# EAGLE design main_v2 (EAGLE 7.5.0)
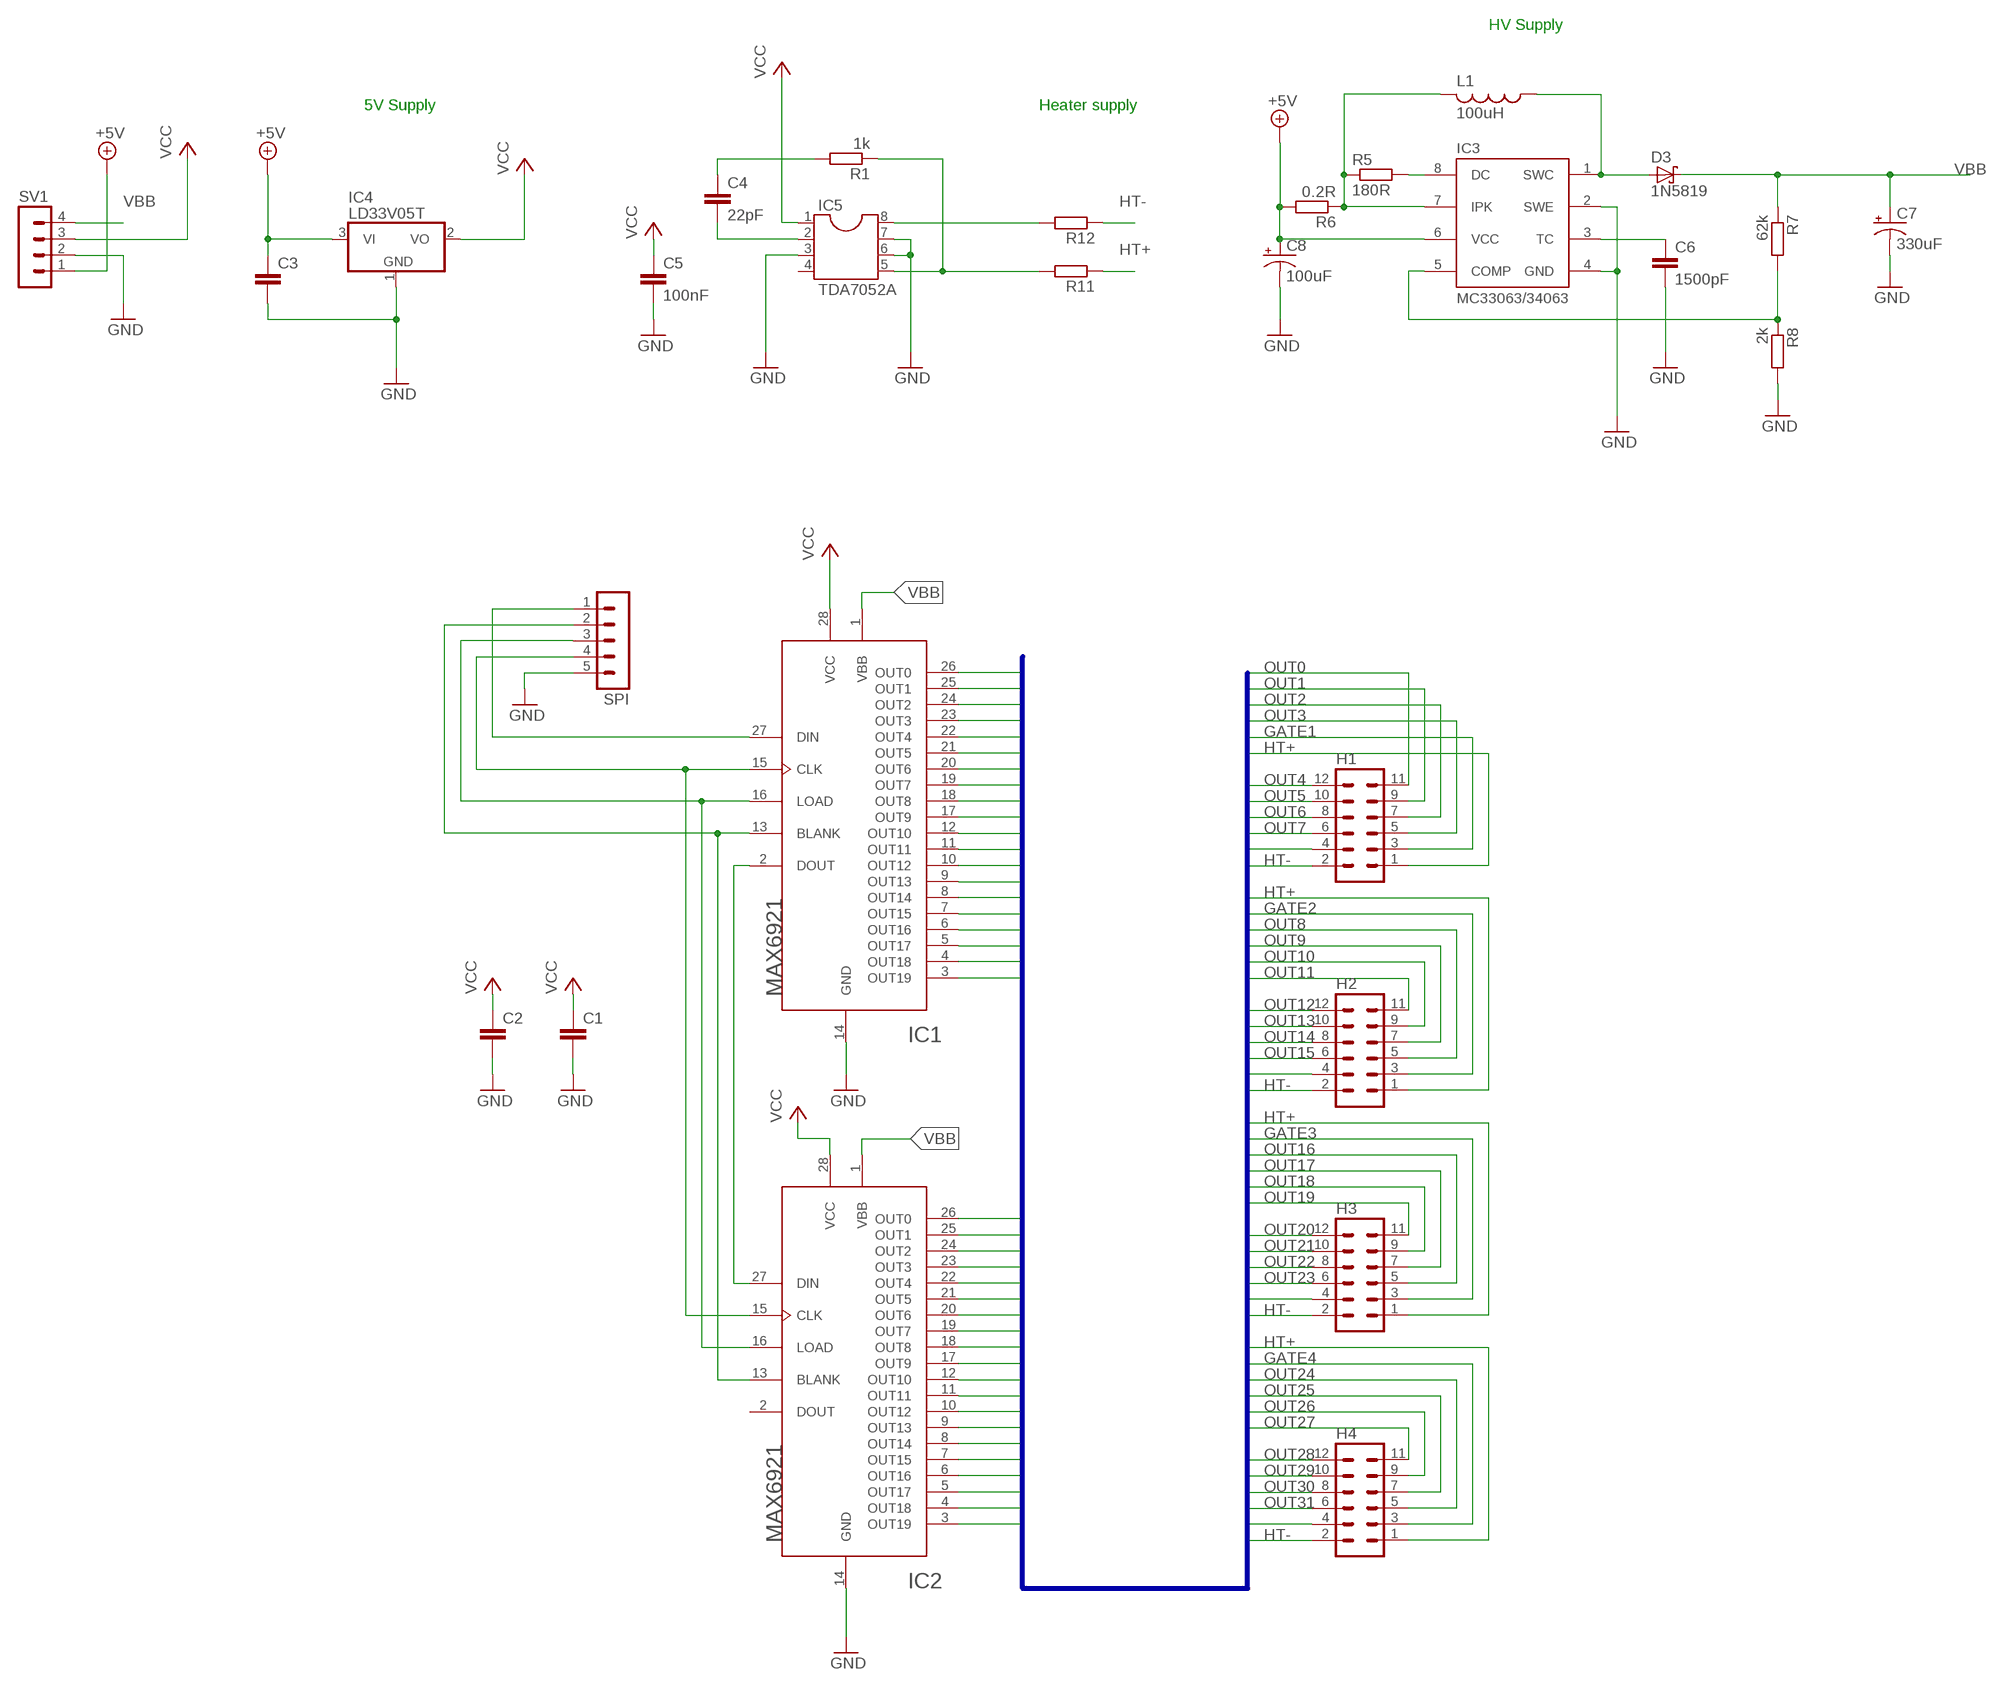
[diagram p0: schematic, sheet 1]

## Parts
C1  C-EU025-025X050  [C025-025X050]
C2  C-EU025-025X050  [C025-025X050]
C3  C-EU025-025X050  [C025-025X050]
C4  22pF  C-EU025-025X050  [C025-025X050]
C5  100nF  C-EU025-025X050  [C025-025X050]
C6  1500pF  C-EU025-025X050  [C025-025X050]
C7  330uF  CPOL-USE3.5-8  [E3,5-8]
C8  100uF  CPOL-USE2.5-5  [E2,5-5]
D3  1N5819  SCHOTTKY-DIODEDO35-7  [DO35-7]
H1  MA06-2  [MA06-2]
H2  MA06-2  [MA06-2]
H3  MA06-2  [MA06-2]
H4  MA06-2  [MA06-2]
IC1  MAX6921  [PLCC-S28]
IC2  MAX6921  [PLCC-S28]
IC3  MC33063  MC33063/MC34063P  [DIL08]
IC4  LD33V05T  [TO220H]
IC5  TDA7052A  DIL8  [DIL08]
L1  100uH  L-US6000-XXX-RC  [6000-XXXX-RC]
R1  1k  R-EU_0204/7  [0204/7]
R5  180R  R-EU_0204/7  [0204/7]
R6  0.2R  R-EU_0207/10  [0207/10]
R7  62k  R-EU_0204/7  [0204/7]
R8  2k  R-EU_0204/7  [0204/7]
R11  R-EU_0204/7  [0204/7]
R12  R-EU_0204/7  [0204/7]
SPI  MA05-1  [MA05-1]
SV1  MA04-1  [MA04-1]

## Nets
+5V: C3.1 C8.+ IC3.6(VCC) IC4.3(VI) R6.2 SV1.1
GATE1: H1.3 IC2.12(OUT10)
GATE2: H2.3 IC2.18(OUT8)
GATE3: H3.3 IC1.12(OUT10)
GATE4: H4.3 IC1.25(OUT1)
GND: C1.2 C2.2 C3.2 C5.2 C6.2 C7.- C8.- IC1.14(GND) IC2.14(GND) IC3.2(SWE) IC3.4(GND) IC4.1(GND) IC5.3 IC5.6 IC5.7 R8.2 SPI.5 SV1.2
HT+: H1.1 H2.1 H3.1 H4.1 R11.1
HT-: H1.2 H2.2 H3.2 H4.2 R12.1
MOSI: IC1.27(DIN) SPI.1
N$1: IC1.2(DOUT) IC2.27(DIN)
N$2: IC5.8 R12.2
N$3: IC1.13(BLANK) IC2.13(BLANK) SPI.2
N$4: IC1.16(LOAD) IC2.16(LOAD) SPI.3
N$5: C6.1 IC3.3(TC)
N$6: IC5.5 R1.1 R11.2
N$7: D3.A IC3.1(SWC) L1.1
N$8: IC3.7(IPK) L1.2 R5.1 R6.1
N$9: IC3.8(DC) R5.2
N$10: C4.2 IC5.2
N$11: IC3.5(COMP) R7.2 R8.1
N$12: C4.1 R1.2
OUT0: H1.11 IC2.10(OUT12)
OUT1: H1.9 IC2.7(OUT15)
OUT2: H1.7 IC2.5(OUT17)
OUT3: H1.5 IC2.11(OUT11)
OUT4: H1.12 IC2.9(OUT13)
OUT5: H1.10 IC2.8(OUT14)
OUT6: H1.8 IC2.6(OUT16)
OUT7: H1.6 IC2.3(OUT19)
OUT8: H2.5 IC2.21(OUT5)
OUT9: H2.7 IC2.23(OUT3)
OUT10: H2.9 IC2.25(OUT1)
OUT11: H2.11 IC2.19(OUT7)
OUT12: H2.12 IC2.20(OUT6)
OUT13: H2.10 IC2.26(OUT0)
OUT14: H2.8 IC2.24(OUT2)
OUT15: H2.6 IC2.22(OUT4)
OUT16: H3.5 IC1.11(OUT11)
OUT17: H3.7 IC1.8(OUT14)
OUT18: H3.9 IC1.9(OUT13)
OUT19: H3.11 IC1.10(OUT12)
OUT20: H3.12 IC1.7(OUT15)
OUT21: H3.10 IC1.6(OUT16)
OUT22: H3.8 IC1.5(OUT17)
OUT23: H3.6 IC1.3(OUT19)
OUT24: H4.5 IC1.23(OUT3)
OUT25: H4.7 IC1.21(OUT5)
OUT26: H4.9 IC1.22(OUT4)
OUT27: H4.11 IC1.19(OUT7)
OUT28: H4.12 IC1.20(OUT6)
OUT29: H4.10 IC1.18(OUT8)
OUT30: H4.8 IC1.17(OUT9)
OUT31: H4.6 IC1.24(OUT2)
SCK: IC1.15(CLK) IC2.15(CLK) SPI.4
SPARE1: H1.4 IC2.4(OUT18)
SPARE2: H2.4 IC2.17(OUT9)
SPARE3: H3.4 IC1.4(OUT18)
SPARE4: H4.4 IC1.26(OUT0)
VBB: C7.+ D3.C IC1.1(VBB) IC2.1(VBB) R7.1 SV1.4
VCC: C1.1 C2.1 C5.1 IC1.28(VCC) IC2.28(VCC) IC4.2(VO) IC5.1 SV1.3
Unconnected: IC2.2(DOUT) IC5.4

## Buses
OUT[0..32],HT+[1..4],HT-,HT+,GATE[1..4],SPARE[1..4]

## Notes on the sheet
- HV Supply
- 5V Supply | Heater supply

## Library data of the parts
C1-C6 = resistor:C-EU: CAPACITOR, European symbol
C7 C8 = adafruit:CPOL-US: POLARIZED CAPACITOR, American symbol
D3 = adafruit:SCHOTTKY-DIODE: Schottky Diode
H1-H4 = con-lstb:MA06-2: PIN HEADER; OC_FARNELL: unknown; OC_NEWARK: unknown
IC1 IC2 = adafruit:MAX6921: MAX6921 76V VFD driver in TSSOP and PLCC. Can be cascaded, talk to it via SPI
IC3 = adafruit:MC33063/MC34063: MC33063 and MC34063 Basic DC/DC converter with internal power-NPN transistor, 100KHz, 1.5A peak switch current. 3-40 input/output.
IC4 = ld33v:LD33V: Positive VOLTAGE REGULATOR Source: http://cache.national.com/ds/LM/LM78L05.pdf http://www.fairchildsemi.com/ds/LM/LM7805.pdf
IC5 = ic-package:DIL8: Dual In Line / Socket
L1 = rcl:L-US: INDUCTOR, American symbol
R1 R5-R8 R11 R12 = resistor:R-EU_: RESISTOR, European symbol
SPI = con-lstb:MA05-1: PIN HEADER; OC_FARNELL: unknown; OC_NEWARK: unknown
SV1 = con-lstb:MA04-1: PIN HEADER; OC_FARNELL: unknown; OC_NEWARK: unknown

## Board
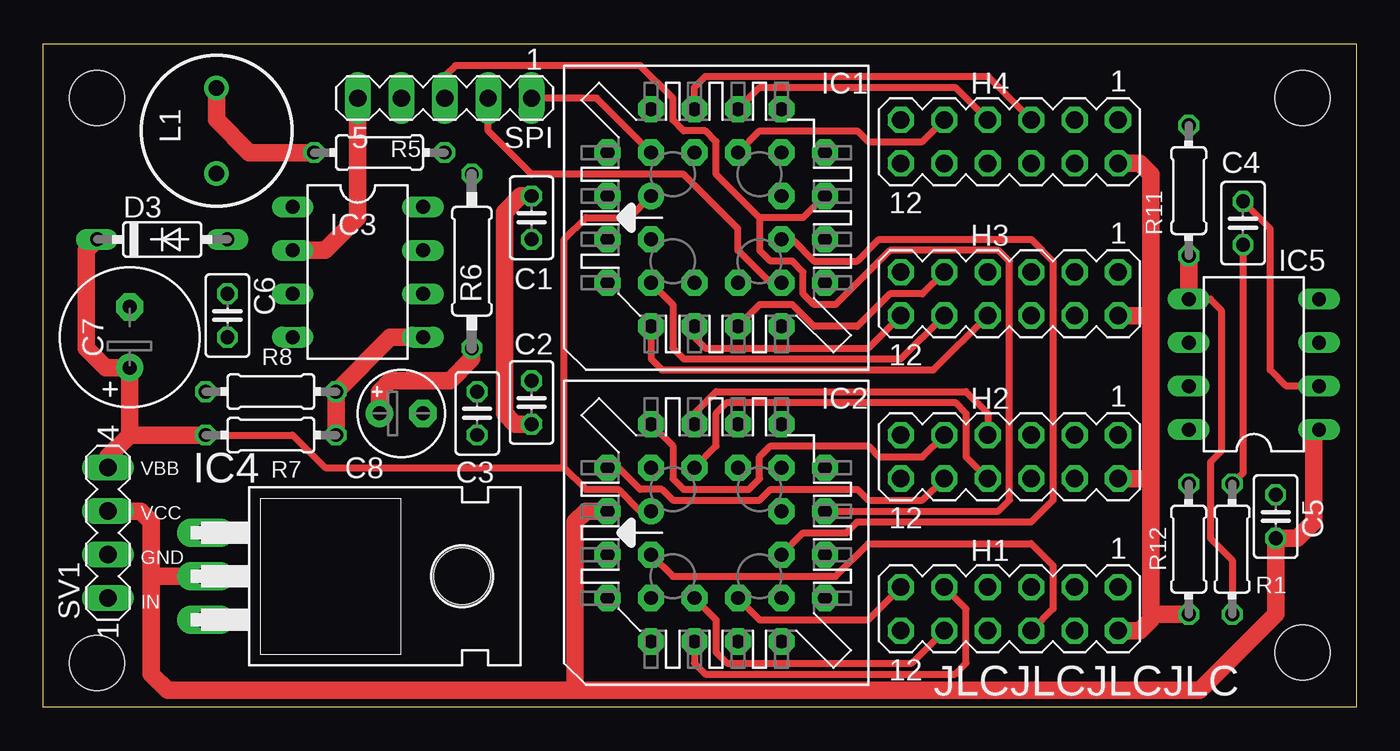
[diagram p1: board, top side]
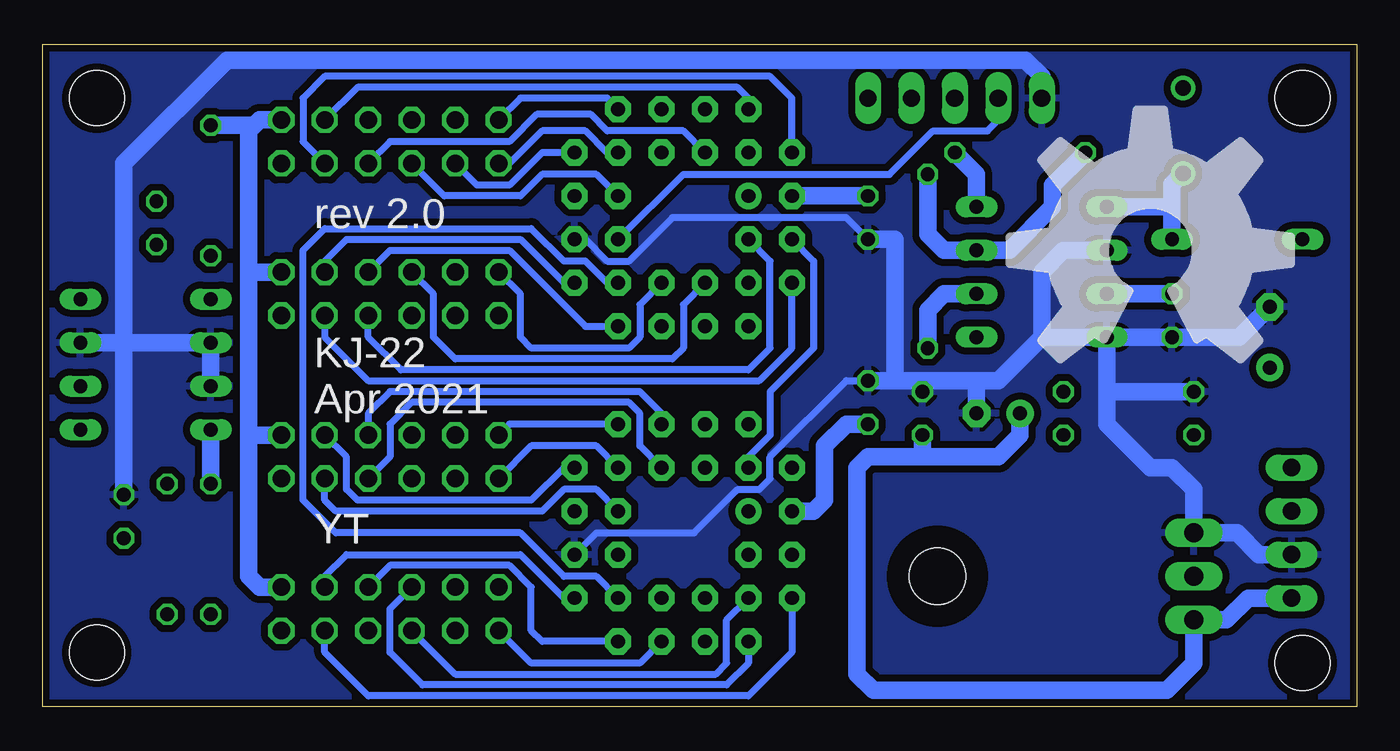
[diagram p2: board, bottom side, seen from below]

Size 76.81 x 38.72 mm. Coordinates in mm from the lower left corner, seen from the top.
Outline: 0,0 76.81,0 76.81,38.72 0,38.72 0,0
Copper layers (1*16): Top 0.035559375mm / dielectric 1.6mm / Bottom 0.035559375mm
Design rules "oshpark dru": minimum track width 6mil, minimum drill 10mil, track to track 6mil, track to pad 6mil, pad to pad 6mil, via to via 6mil, smd to smd 6mil, copper to edge 15mil, drill to drill 6mil, minimum pad ring 5mil, minimum via ring 5mil, stop-mask expansion 2.5mil, vias tented up to drill 0mil, thermal gap 10mil
Holes 3.2 mm at 3.17,2.54 3.17,35.56 73.66,3.17 73.66,35.56

### Footprints (pad centres in the part's own frame; a part is rotated, then mirrored left to right if it is on the bottom)
C025-025X050 = drill 0.813 octagon: 1 -1.27,0; 2 1.27,0
E3,5-8 = drill 0.813 pad 1.6: + -1.778,0 | drill 0.813 pad 1.6 octagon: - 1.778,0
E2,5-5 = drill 0.813 pad 1.6: + -1.27,0 | drill 0.813 pad 1.6 octagon: - 1.27,0
DO35-7 = drill 0.813 long: A 3.81,0; C -3.81,0
MA06-2 = drill 1.016 octagon: 1 -6.35,-1.27; 2 -6.35,1.27; 3 -3.81,-1.27; 4 -3.81,1.27; 5 -1.27,-1.27; 6 -1.27,1.27; 7 1.27,-1.27; 8 1.27,1.27; 9 3.81,-1.27; 10 3.81,1.27; 11 6.35,-1.27; 12 6.35,1.27
PLCC-S28 = drill 0.813 pad 1.524: 1 1.27,3.81 | drill 0.813 pad 1.524 octagon: 2 -1.27,6.35; 3 -1.27,3.81; 4 -3.81,6.35; 5 -6.35,3.81; 6 -3.81,3.81; 7 -6.35,1.27; 8 -3.81,1.27; 9 -6.35,-1.27; 10 -3.81,-1.27; 11 -6.35,-3.81; 12 -3.81,-6.35; 13 -3.81,-3.81; 14 -1.27,-6.35; 15 -1.27,-3.81; 16 1.27,-6.35; 17 1.27,-3.81; 18 3.81,-6.35; 19 6.35,-3.81; 20 3.81,-3.81; 21 6.35,-1.27; 22 3.81,-1.27; 23 6.35,1.27; 24 3.81,1.27; 25 6.35,3.81; 26 3.81,6.35; 27 3.81,3.81; 28 1.27,6.35
DIL08 = drill 0.813 long: 1 -3.81,-3.81; 2 -1.27,-3.81; 3 1.27,-3.81; 4 3.81,-3.81; 5 3.81,3.81; 6 1.27,3.81; 7 -1.27,3.81; 8 -3.81,3.81
TO220H = drill 1.118 long: 1 -2.54,-10.16; 2 0,-10.16; 3 2.54,-10.16 | hole 3.302: 0,4.826
6000-XXXX-RC = drill 0.9 pad 1.422: 1 -2.5,0; 2 2.5,0
0204/7 = drill 0.813 octagon: 1 -3.81,0; 2 3.81,0
0207/10 = drill 0.813 octagon: 1 -5.08,0; 2 5.08,0
MA05-1 = drill 1.016 long: 1 -5.08,0; 2 -2.54,0; 3 0,0; 4 2.54,0; 5 5.08,0
MA04-1 = drill 1.016 long: 1 -3.81,0; 2 -1.27,0; 3 1.27,0; 4 3.81,0

### Placement (x,y rotation side)
C1  28.57,17.78 90 top
C2  28.57,28.57 270 top
C3  25.4,17.14 90 top
C4  70.17,28.26 90 top
C5  72.07,11.11 90 top
C6  10.79,22.86 270 top
C7  5.08,21.59 90 top
C8  20.95,17.14 0 top
D3  6.99,27.3 0 top
H1  56.52,5.71 180 top
H2  56.52,14.61 180 top
H3  56.52,24.13 180 top
H4  56.52,33.02 180 top
IC1  39.37,28.57 90 top
IC2  39.37,10.16 90 top
IC3  18.41,25.4 270 top
IC4  19.68,7.62 270 top
IC5  70.8,20 90 top
L1  10.16,33.66 90 top
R1  69.53,9.21 90 top
R5  19.68,32.38 0 top
R6  25.08,26.04 270 top
R7  13.34,15.88 0 top
R8  13.34,18.41 180 top
R11  66.99,30.16 270 top
R12  66.99,9.21 90 top
SPI  23.5,35.56 180 top
SV1  3.81,10.16 90 top

### Tracks (layer width: path | path; a pad name or v marks a point on that pad's centre or on a via)
+5V
  Top 1.016: C8.+ 19.68,18.41 20.32,19.05 23.81,19.05 25.08,20.32 R6.2
  Bottom 1.016: IC3.6 24.13,24.13 25.08,23.18 R6.2 | SV1.1 6.35,6.35 7.62,5.08 IC4.3 9.53,2.54 11.11,0.95 28.26,0.95 29.21,1.91 29.21,13.97 28.57,14.61 25.4,14.61 | C8.+ 19.68,15.88 20.95,14.61 25.4,14.61 | C3.1 25.4,14.61
GATE1
  Bottom 0.406: H1.3 60.33,7.62 59.05,8.89 48.9,8.89 46.35,6.35 IC2.12
GATE2
  Bottom 0.406: IC2.18 46.35,13.97 48.26,12.06 58.42,12.06 59.05,12.7 59.05,14.61 H2.3
GATE3
  Bottom 0.406: H3.3 60.33,26.04 59.05,27.3 48.9,27.3 46.35,24.77 IC1.12
GATE4
  Bottom 0.406: IC1.25 35.56,35.56 36.2,36.2 58.42,36.2 H4.3
GND
  Top 1.016: SPI.5 18.41,28.57 16.51,26.67 IC3.2
  Bottom 0.406: IC2.14 44.45,10.16 38.73,10.16 36.2,12.7 34.92,12.7 34.29,13.34 34.29,14.61 29.84,19.05 C1.2 | C2.2 29.84,28.57 40.01,28.57 42.55,26.04 43.81,26.04 45.09,27.3 IC1.14
  Bottom 1.016: 18.41,21.59 18.41,25.4 17.14,26.67 IC3.2 | 18.41,21.59 IC3.4 | IC3.4 C6.2 6.86,21.59 C7.- | C8.- 22.23,19.05 | 18.41,21.59 20.95,19.05 22.23,19.05 | 14.61,18.41 14.61,16.51 12.06,13.97 10.79,13.97 9.53,12.7 IC4.1 6.99,10.16 5.71,8.89 SV1.2 | 14.61,18.41 IC3.4 | R8.2 14.61,18.41 | 72.07,21.27 IC5.6 IC5.7 | 72.07,21.27 IC5.3 | C2.2 26.99,27.3 26.99,19.37 26.67,19.05 | 22.23,19.05 25.4,19.05 | 25.4,19.05 26.67,19.05 | C3.2 25.4,19.05 | C1.2 26.67,19.05 | SPI.5 18.41,36.83 19.37,37.78 66.04,37.78 72.07,31.75 72.07,21.27 | C5.2 72.07,21.27
  pour Bottom (isolate 0.406): 0,0 76.83,0 76.83,38.73 0,38.73
HT+
  Bottom 1.016: H4.1 64.14,34.29 64.45,33.97 | 64.45,33.97 64.77,33.66 64.77,25.4 | 64.77,25.4 64.77,15.88 | 64.77,15.88 64.77,7.62 64.14,6.99 H1.1 | H3.1 64.77,25.4 | H2.1 64.77,15.88 | R11.1 64.45,33.97
HT-
  Top 1.016: H1.2 64.14,4.45 64.77,5.08 64.77,5.4 | 64.77,5.4 64.77,13.34 | H2.2 64.77,13.34 | 64.77,13.34 64.77,22.86 | 64.77,22.86 64.77,31.11 64.14,31.75 H4.2 | H3.2 64.77,22.86 | R12.1 64.77,5.4
MOSI
  Top 0.406: IC1.27 32.38,35.56 SPI.1
N$1
  Bottom 0.406: IC1.2 31.75,26.04 31.75,20.95 34.29,18.41 34.29,15.88 35.56,14.61 IC2.27
N$2
  Bottom 1.016: IC5.8 R12.2
N$3
  Top 0.406: IC1.13 42.55,24.77 40.64,26.67 40.64,27.94 37.47,31.11 28.57,31.11 26.04,33.66 SPI.2
  Bottom 0.406: IC2.13 44.45,7.62 46.35,7.62 48.9,10.16 59.69,10.16 61.59,12.06 61.59,26.67 60.33,27.94 48.26,27.94 46.35,26.04 45.09,26.04 43.81,24.77 IC1.13
N$4
  Top 0.406: IC2.16 55.88,11.43 56.52,12.06 56.52,26.04 55.88,26.67 49.53,26.67 46.35,23.5 45.09,23.5 44.45,24.13 44.45,25.4 43.81,26.04 42.55,26.04 41.91,26.67 41.91,28.57 | IC1.16 44.45,28.57 41.91,28.57 | 41.91,28.57 39.37,31.11 39.37,33.02 38.73,33.66 37.47,33.66 36.83,34.29 36.83,35.56 34.92,37.47 24.13,37.47 23.5,36.83 SPI.3
N$5
  Bottom 1.016: C6.1 IC3.3
N$6
  Top 0.406: IC5.5 68.26,23.81 68.9,23.18 68.9,14.92 68.26,14.29 68.26,9.84 69.53,8.57 R1.1
  Top 1.016: IC5.5 R11.2
N$7
  Bottom 1.016: 14.64,29.25 IC3.1 10.79,29.21 D3.A 10.79,30.52 L1.1
N$8
  Top 1.016: R5.1 12.06,32.38 10.16,34.29 L1.2
  Bottom 1.016: R6.1 25.08,27.62 24.13,26.67 IC3.7 20.32,26.67 17.78,29.21 17.78,30.48 R5.1
N$9
  Bottom 1.016: IC3.8 22.23,31.11 R5.2
N$10
  Top 0.406: IC5.2 72.71,18.73 71.75,19.68 71.75,27.94 C4.2
N$11
  Top 1.016: R7.2 R8.1 20.32,21.59 IC3.5
N$12
  Top 0.406: C4.1 70.17,13.65 R1.2
OUT0
  Top 0.406: IC2.10 41.91,5.08 48.26,5.08 H1.11
OUT1
  Top 0.406: IC2.7 38.1,2.54 38.73,1.91 53.34,1.91 53.98,2.54 53.98,5.71 H1.9
OUT2
  Bottom 0.406: IC2.5 35.56,2.54 36.83,1.27 54.61,1.27 56.52,3.17 56.52,5.71 H1.7
OUT3
  Bottom 0.406: H1.5 56.52,8.26 49.53,8.26 48.26,6.99 48.26,4.45 47.62,3.81 IC2.11
OUT4
  Bottom 0.406: IC2.9 41.91,2.54 48.26,2.54 H1.12
OUT5
  Top 0.406: IC2.8 39.37,5.08 39.37,3.17 40.01,2.54 50.8,2.54 H1.10
OUT6
  Bottom 0.406: H1.8 52.7,1.91 37.47,1.91 36.83,2.54 36.83,5.08 IC2.6
OUT7
  Top 0.406: IC2.3 36.83,7.62 46.35,7.62 48.26,9.53 57.78,9.53 59.05,8.26 59.05,5.71 H1.6
OUT8
  Bottom 0.406: IC2.21 40.64,17.14 41.91,18.41 56.52,18.41 57.78,17.14 H2.5
OUT9
  Top 0.406: IC2.23 38.1,17.14 39.37,18.41 53.98,18.41 55.24,17.14 H2.7
OUT10
  Top 0.406: IC2.25 36.83,15.24 36.83,13.34 37.47,12.7 41.27,12.7 41.91,13.34 41.91,14.61 42.55,15.24 48.26,15.24 48.9,14.61 51.44,14.61 H2.9
OUT11
  Bottom 0.406: IC2.19 49.53,16.51 H2.11
OUT12
  Bottom 0.406: IC2.20 44.45,15.24 48.26,15.24 H2.12
OUT13
  Top 0.406: H2.10 51.44,12.06 48.26,12.06 47.62,12.7 42.55,12.7 41.91,12.06 36.83,12.06 36.2,12.7 34.92,12.7 33.66,13.97 IC2.26
OUT14
  Top 0.406: IC2.24 39.37,15.24 39.37,17.14 40.01,17.78 53.34,17.78 53.98,17.14 53.98,14.61 H2.8
OUT15
  Bottom 0.406: IC2.22 41.91,15.24 41.91,17.14 42.55,17.78 55.24,17.78 56.52,16.51 56.52,14.61 H2.6
OUT16
  Bottom 0.406: H3.5 56.52,26.67 49.53,26.67 45.09,22.23 IC1.11
OUT17
  Bottom 0.406: IC1.8 39.37,23.5 39.37,20.95 40.01,20.32 52.7,20.32 53.98,21.59 53.98,24.13 H3.7
OUT18
  Top 0.406: H3.9 51.44,24.13 49.53,24.13 47.62,22.23 45.09,22.23 43.81,23.5 41.91,23.5 IC1.9
OUT19
  Bottom 0.406: IC1.10 41.91,23.5 41.91,21.59 42.55,20.95 48.26,20.95 48.9,21.59 48.9,24.13 H3.11
OUT20
  Top 0.406: IC1.7 38.1,21.59 38.73,20.95 48.26,20.95 H3.12
OUT21
  Top 0.406: IC1.6 36.83,23.5 36.83,20.95 37.47,20.32 50.16,20.32 H3.10
OUT22
  Top 0.406: IC1.5 35.56,20.32 36.2,19.68 52.07,19.68 H3.8
OUT23
  Bottom 0.406: H3.6 57.78,21.59 55.88,19.68 35.56,19.68 34.29,20.95 34.29,26.04 IC1.3
OUT24
  Top 0.406: IC1.23 38.1,36.2 38.73,36.83 55.24,36.83 H4.5
OUT25
  Top 0.406: IC1.21 41.91,36.2 53.34,36.2 H4.7
OUT26
  Top 0.406: IC1.22 41.91,33.66 47.62,33.66 48.26,33.02 51.44,33.02 H4.9
OUT27
  Bottom 0.406: IC1.19 43.81,35.56 48.9,35.56 H4.11
OUT28
  Bottom 0.406: IC1.20 43.81,32.38 45.09,33.66 47.62,33.66 49.53,31.75 H4.12
OUT29
  Bottom 0.406: IC1.18 47.62,32.38 49.53,30.48 51.44,30.48 H4.10
OUT30
  Bottom 0.406: IC1.17 44.45,31.11 47.62,31.11 48.9,29.84 53.34,29.84 H4.8
OUT31
  Bottom 0.406: IC1.24 39.37,33.66 43.81,33.66 44.77,34.61 47.94,34.61 49.53,33.02 56.52,33.02 H4.6
SCK
  Top 0.406: IC2.15 44.45,10.16 46.99,10.16 47.62,10.79 57.78,10.79 59.05,12.06 59.05,26.04 57.78,27.3 48.9,27.3 47.62,26.04 45.09,26.04 43.81,27.3 IC1.15
  Bottom 0.406: IC1.15 39.37,31.11 27.3,31.11 24.77,33.66 21.59,33.66 20.95,34.29 SPI.4
SPARE1
  Bottom 0.406: IC2.4 33.02,3.17 35.56,0.64 57.78,0.64 60.33,3.17 H1.4
SPARE2
  Bottom 0.406: IC2.17 44.45,12.7 46.35,12.7 47.62,11.43 59.69,11.43 60.33,12.06 H2.4
SPARE3
  Bottom 0.406: H3.4 60.33,21.59 57.78,19.05 34.92,19.05 33.02,20.95 IC1.4
SPARE4
  Bottom 0.406: IC1.26 33.02,35.56 34.29,36.83 60.33,36.83 61.59,35.56 61.59,33.02 H4.4
VBB
  Top 0.406: R7.1 14.61,15.88 16.51,13.97 30.48,13.97 | 30.48,13.97 31.75,12.7 33.66,12.7 34.92,11.43 IC2.1 | 30.48,13.97 30.48,27.3 31.75,28.57 34.29,28.57 IC1.1
  Top 1.016: SV1.4 3.81,14.61 5.08,15.88 | 5.08,15.88 R7.1 | 5.08,15.88 C7.+ 3.68,19.81 2.54,20.95 2.54,26.67 D3.C
VCC
  Top 1.016: 31.11,0.95 67.63,0.95 72.07,5.4 C5.1 73.34,9.84 74.3,10.79 74.3,15.88 IC5.1 | 31.11,0.95 7.3,0.95 6.35,1.91 6.35,7.62 | 6.35,7.62 IC4.2 | 6.35,7.62 6.35,10.79 5.71,11.43 SV1.3 | IC2.28 31.75,11.43 31.11,10.79 31.11,0.95 | C1.1 27.62,16.51 26.99,17.14 26.99,28.89 27.94,29.84 C2.1
  Bottom 1.016: C1.1 29.84,16.51 31.11,15.24 31.11,12.06 31.75,11.43 IC2.28 | C2.1 IC1.28

### Text on the board
tPlace: VBB / VCC / GND / IN | JLCJLCJLCJLC
bPlace: rev 2.0 | KJ-22 / Apr 2021 | YT